# EasyEDA schematic ESP32_layout.json

## Sheets
1 schema_proto2
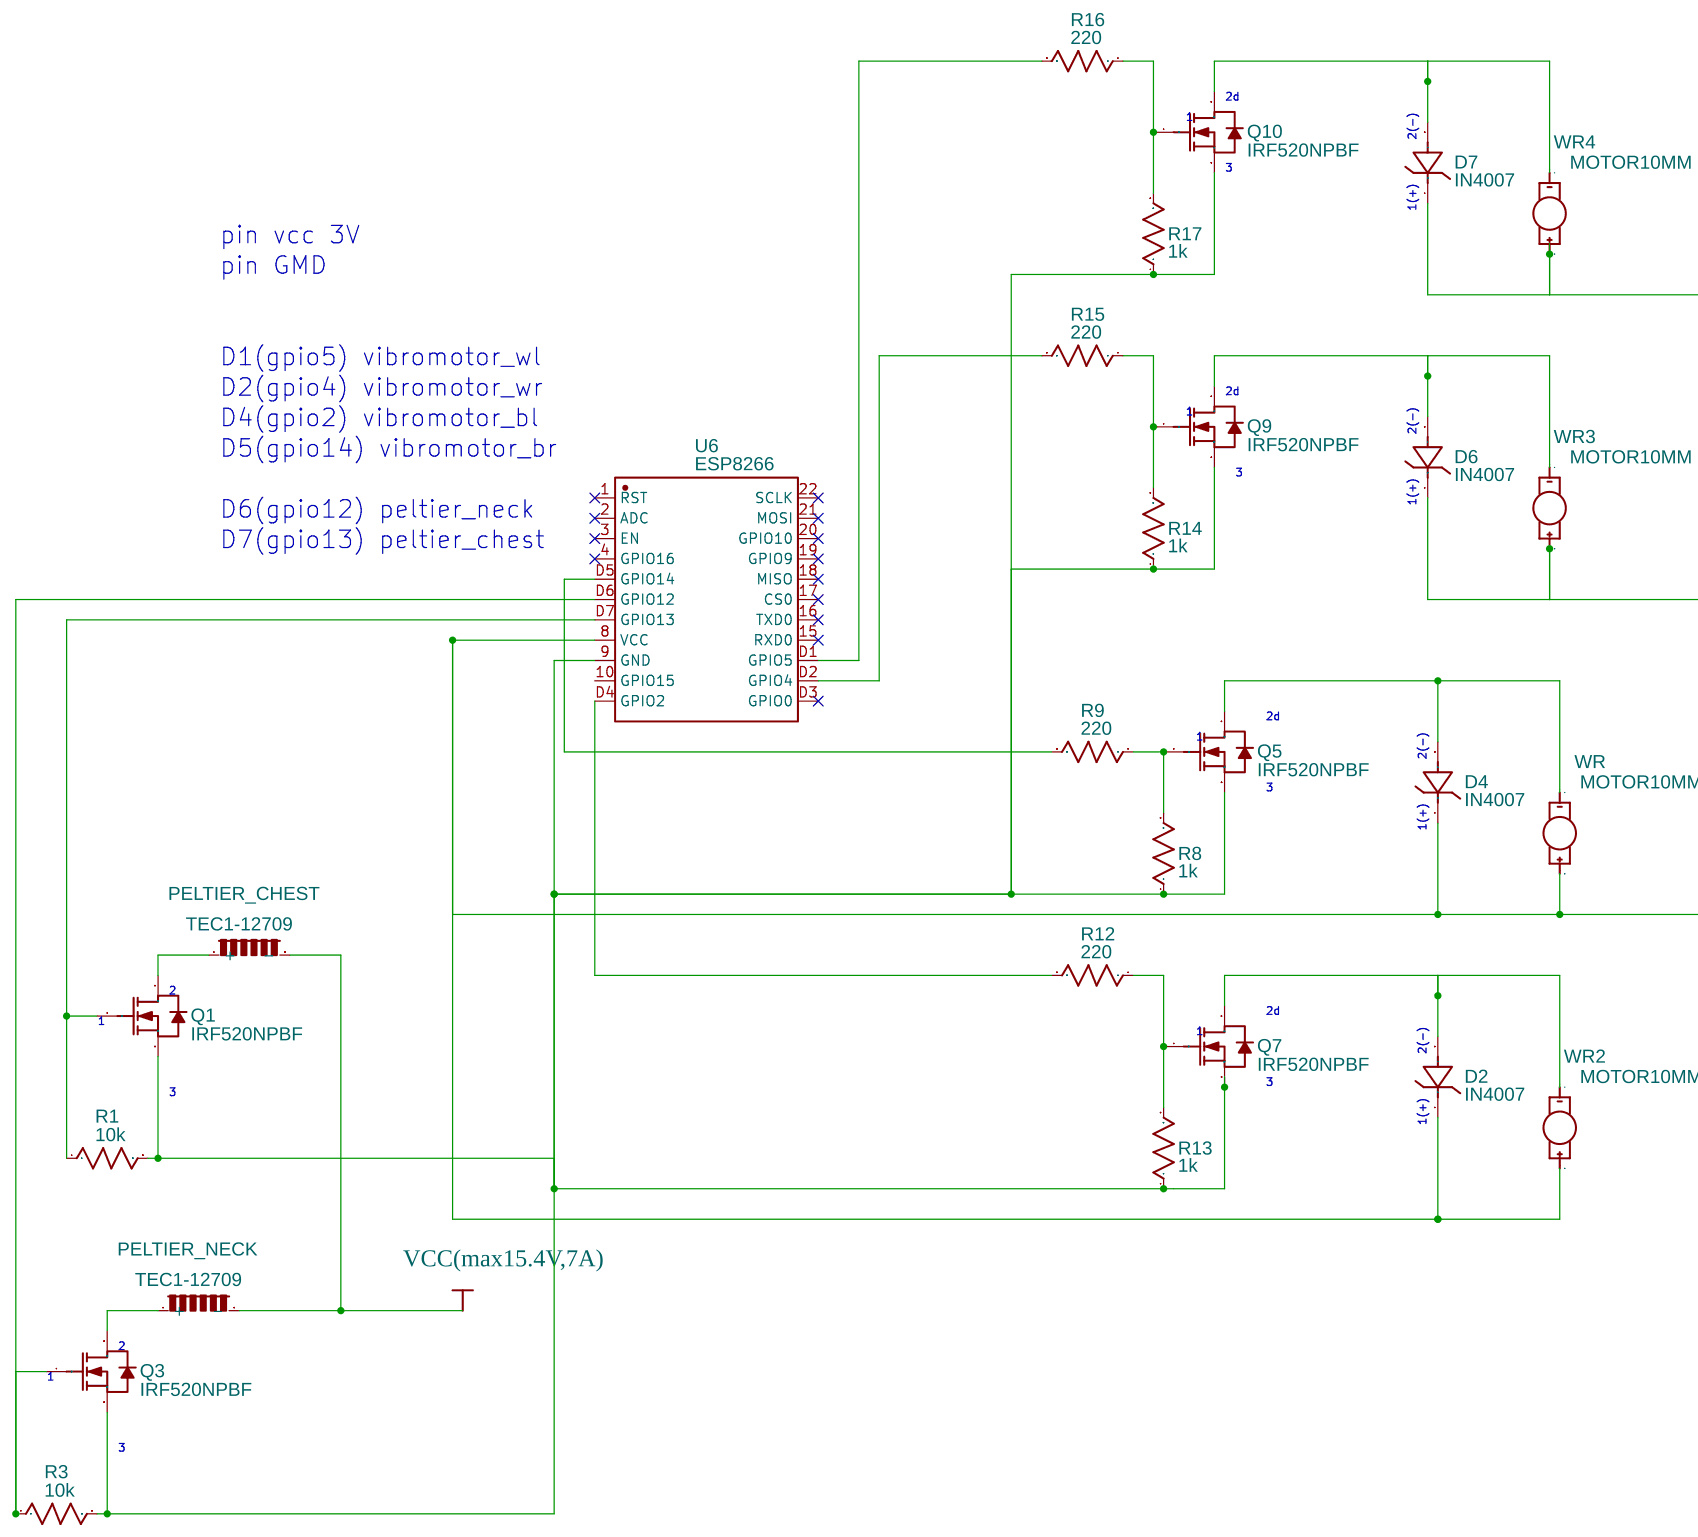
[diagram p0: schema_proto2]
2 schema_motor_details: TITLE: Sheet_2; REV: 1.0; Date: 2024-03-13; Sheet: 1/1; Drawn By: alexcappellett; Company: Your Company
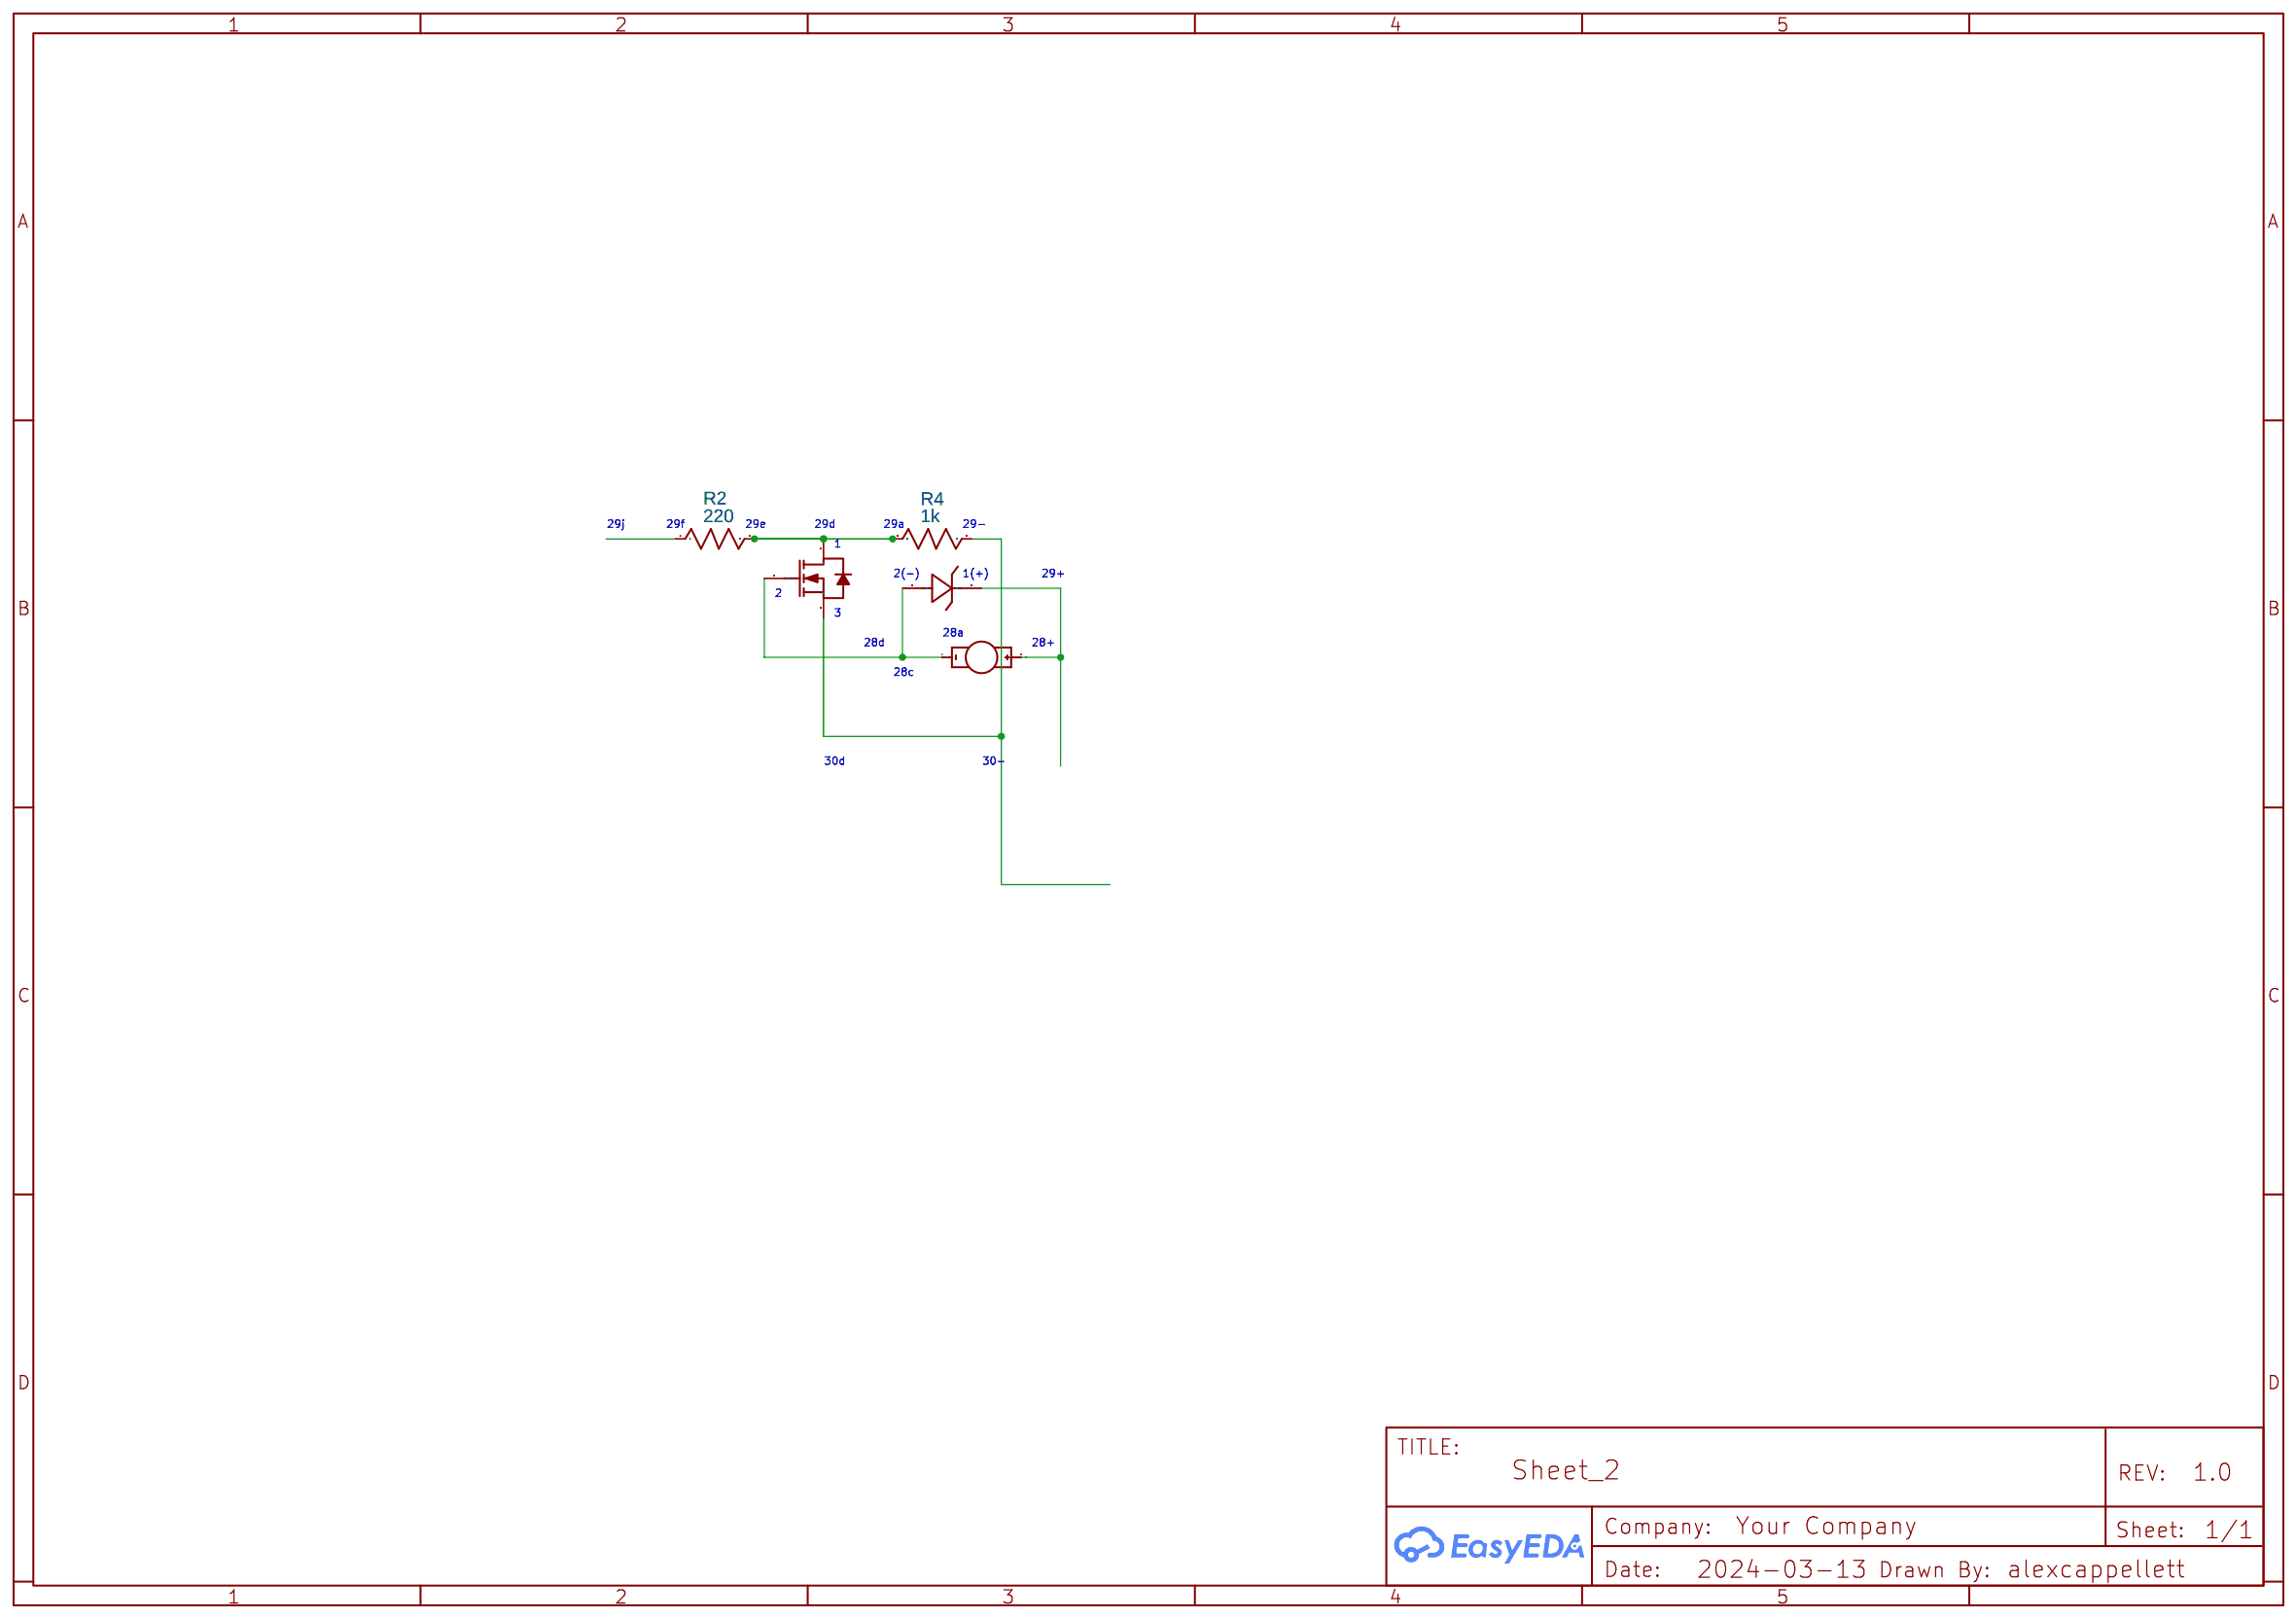
[diagram p1: schema_motor_details]
3 Sheet_2: TITLE: Sheet_2; REV: 1.0; Date: 2024-03-14; Sheet: 1/1; Drawn By: alexcappellett; Company: Your Company
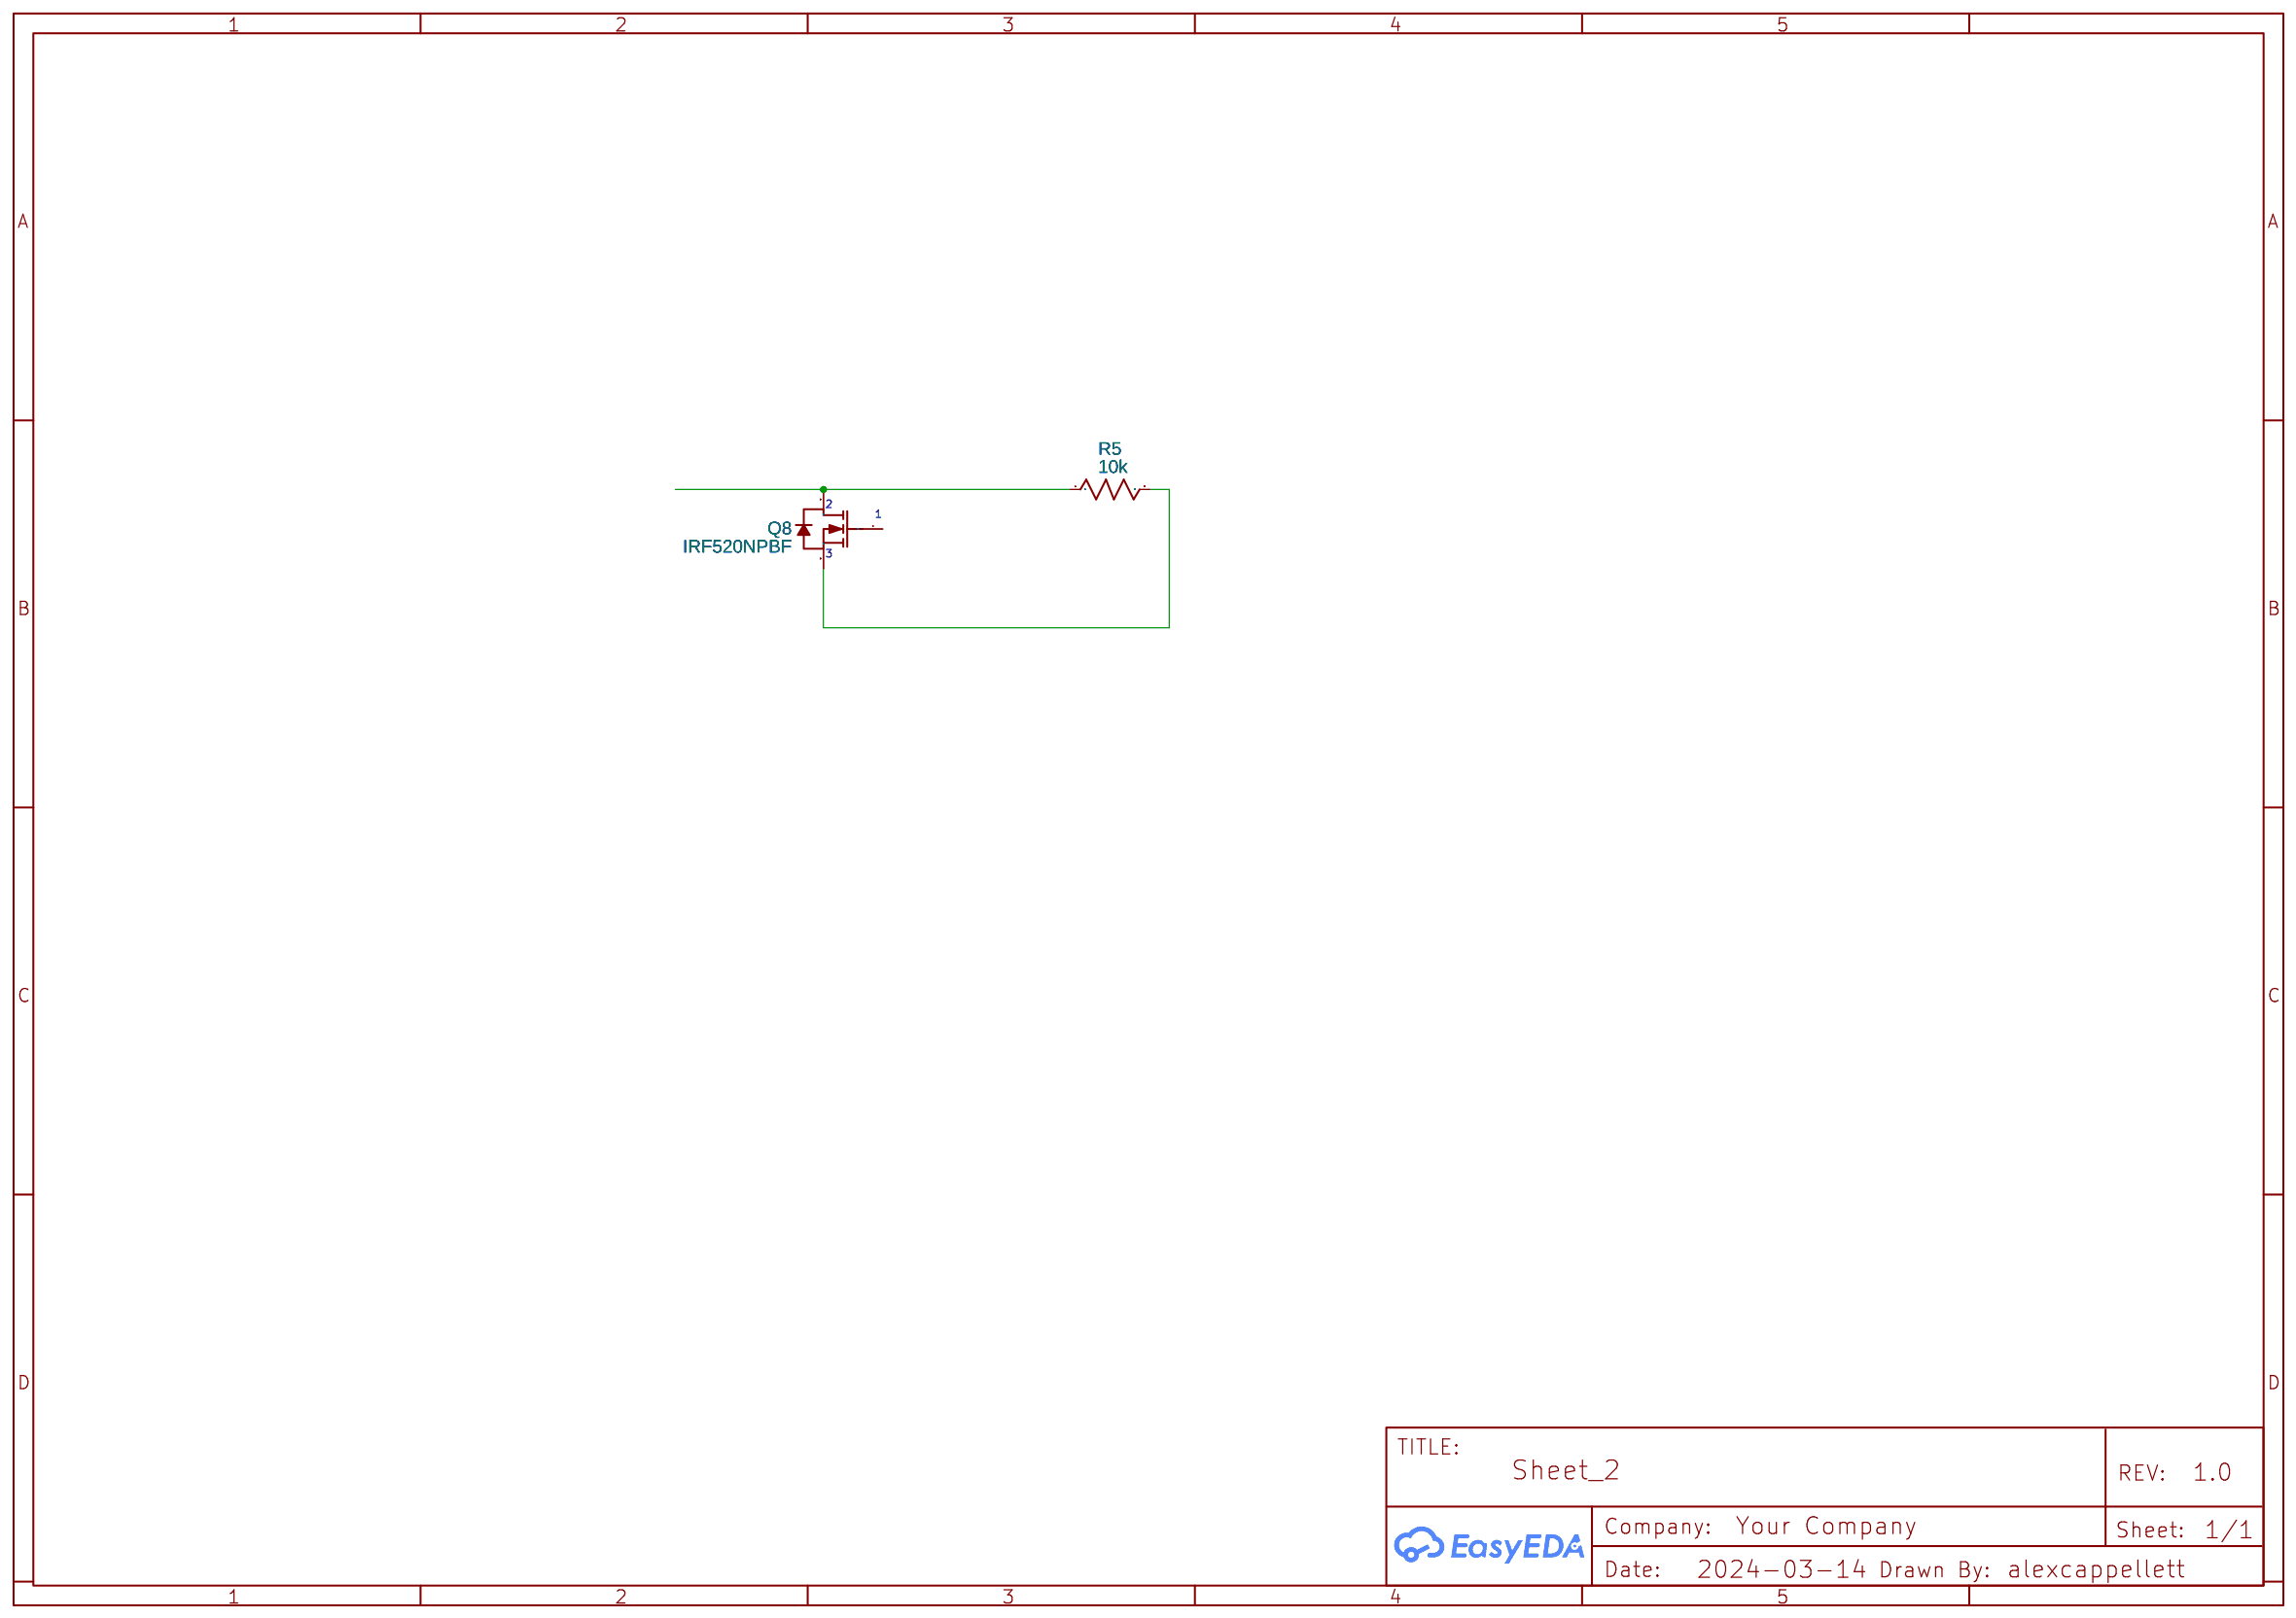
[diagram p2: Sheet_2]

## Parts
sheet schema_motor_details
D1  IN4007  [SMA_L4.3-W2.6-LS5.1-RD]
Q2  IRF520NPBF  [TO-220-3_L10.0-W4.5-P2.54-T]
R2  220  [R0603]
R4  1k  [R0603]
WR1  MOTOR10MM  [VIBE-MOTOR-10MM]
sheet schema_proto2
D2  IN4007  [SMA_L4.3-W2.6-LS5.1-RD]
D4  IN4007  [SMA_L4.3-W2.6-LS5.1-RD]
D6  IN4007  [SMA_L4.3-W2.6-LS5.1-RD]
D7  IN4007  [SMA_L4.3-W2.6-LS5.1-RD]
PELTIER_CHEST  TEC1-12709
PELTIER_NECK  TEC1-12709
Q1  IRF520NPBF  [TO-220-3_L10.0-W4.5-P2.54-T]
Q3  IRF520NPBF  [TO-220-3_L10.0-W4.5-P2.54-T]
Q5  IRF520NPBF  [TO-220-3_L10.0-W4.5-P2.54-T]
Q7  IRF520NPBF  [TO-220-3_L10.0-W4.5-P2.54-T]
Q9  IRF520NPBF  [TO-220-3_L10.0-W4.5-P2.54-T]
Q10  IRF520NPBF  [TO-220-3_L10.0-W4.5-P2.54-T]
R1  10k  [R0603]
R3  10k  [R0603]
R8  1k  [R0603]
R9  220  [R0603]
R12  220  [R0603]
R13  1k  [R0603]
R14  1k  [R0603]
R15  220  [R0603]
R16  220  [R0603]
R17  1k  [R0603]
U6  ESP8266  [WIFIM-SMD_ESP-12F-ESP8266MOD]
WR  MOTOR10MM  [VIBE-MOTOR-10MM]
WR2  MOTOR10MM  [VIBE-MOTOR-10MM]
WR3  MOTOR10MM  [VIBE-MOTOR-10MM]
WR4  MOTOR10MM  [VIBE-MOTOR-10MM]
sheet Sheet_2
Q8  IRF520NPBF  [TO-220-3_L10.0-W4.5-P2.54-T]
R5  10k  [R0603]

## Library data of the parts
D1 D2 D4 D6 D7 = IN4007: Contributor: LCSC; Supplier: LCSC; Supplier Part: C9900004719; JLCPCB Part Class: Extended Part; Manufacturer: null
Q1-Q3 Q5 Q7-Q10 = IRF520NPBF: Supplier: LCSC; Manufacturer: Infineon(英飞凌); Supplier Part: C2598; JLCPCB Part Class: Extended Part
R1-R5 R8 R9 R12-R17 = R_0603_US: Contributor: LCEDA_Lib
WR WR1-WR4 = MOTOR10MM: Vibration Motor- ROB-08449; Contributor: SparkFun
PELTIER_CHEST PELTIER_NECK = Peltier_Element: Contributor: KiCAD; license: https://www.gnu.org/licenses/lgpl-2.1.html
U6 = ESP8266: LINK: https://img.jlc.com/image//data/smt-stock-produce/componentSizePhoto/2021-12-02/b5eb61357b2a478295008aee8c894ebd/BG2111290693_D21112900056_font.png; Contributor: LCSC; Supplier: LCSC; Supplier Part: C9900003049; Manufacturer: null; JLCPCB Part Class: Extended Part

## Nets
VCC(max15.4V,7A): PELTIER_CHEST.2(-) PELTIER_NECK.2(-)
Net-(D1-1): D1.1(C) WR1.+
Net-(D1-2): D1.2(A) Q2.1(G) WR1.-
Net-(D2-1): D2.1(C) D4.1(C) D6.1(C) D7.1(C) U6.8(VCC) WR.+ WR2.+ WR3.+ WR4.+
Net-(D2-2): D2.2(A) Q7.2(D) WR2.-
Net-(D4-2): D4.2(A) Q5.2(D) WR.-
Net-(D6-2): D6.2(A) Q9.2(D) WR3.-
Net-(D7-2): D7.2(A) Q10.2(D) WR4.-
Net-(PELTIER_CHEST-1): PELTIER_CHEST.1(+) Q1.2(D)
Net-(PELTIER_NECK-1): PELTIER_NECK.1(+) Q3.2(D)
Net-(Q1-1): Q1.1(G) R1.1 U6.D7(GPIO13)
Net-(Q1-3): Q1.3(S) Q3.3(S) Q5.3(S) Q7.3(S) Q9.3(S) Q10.3(S) R1.2 R3.2 R8.1 R13.1 R14.1 R17.1 U6.9(GND)
Net-(Q2-2): Q2.2(D) R2.2 R4.1
Net-(Q2-3): Q2.3(S) R4.2
Net-(Q3-1): Q3.1(G) R3.1 U6.D6(GPIO12)
Net-(Q5-1): Q5.1(G) R8.2 R9.1
Net-(Q7-1): Q7.1(G) R12.1 R13.2
Net-(Q8-2): Q8.2(D) R5.1
Net-(Q8-3): Q8.3(S) R5.2
Net-(Q9-1): Q9.1(G) R14.2 R15.1
Net-(Q10-1): Q10.1(G) R16.1 R17.2
Net-(R9-2): R9.2 U6.D5(GPIO14)
Net-(R12-2): R12.2 U6.D4(GPIO2)
Net-(R15-2): R15.2 U6.D2(GPIO4)
Net-(R16-2): R16.2 U6.D1(GPIO5)

Not connected (* = marked no-connect by the designer): Q8 1(G); R2 1; U6 1(RST)* 2(ADC)* 3(EN)* 4(GPIO16)* 10(GPIO15) 15(RXD0)* 16(TXD0)* 17(CS0)* 18(MISO)* 19(GPIO9)* 20(GPIO10)* 21(MOSI)* 22(SCLK)* D3(GPIO0)*

## Notes on the sheets
sheet 1
- 2d
- 1
- 2(-)
- 3
- pin vcc 3V
- 1(+)
- pin GMD
- D1(gpio5) vibromotor_wl
- D2(gpio4) vibromotor_wr
- 2d
- D4(gpio2) vibromotor_bl
- 1
- D5(gpio14) vibromotor_br
- 2(-)
- 3
- D6(gpio12) peltier_neck
- 1(+)
- D7(gpio13) peltier_chest
- 1
- 2d
- 2(-)
- 3
- 1(+)
- 2
- 1
- 2d
- 1
- 2(-)
- 3
- 3
- 1(+)
- 2
- 1
- 3
sheet 2
- 29j
- 29f
- 29e
- 29d
- 29a
- 29-
- 1
- 2(-)
- 1(+)
- 29+
- 2
- 3
- 28a
- 28d
- 28+
- 28c
- 30d
- 30-
sheet 3
- 2
- 1
- 3
